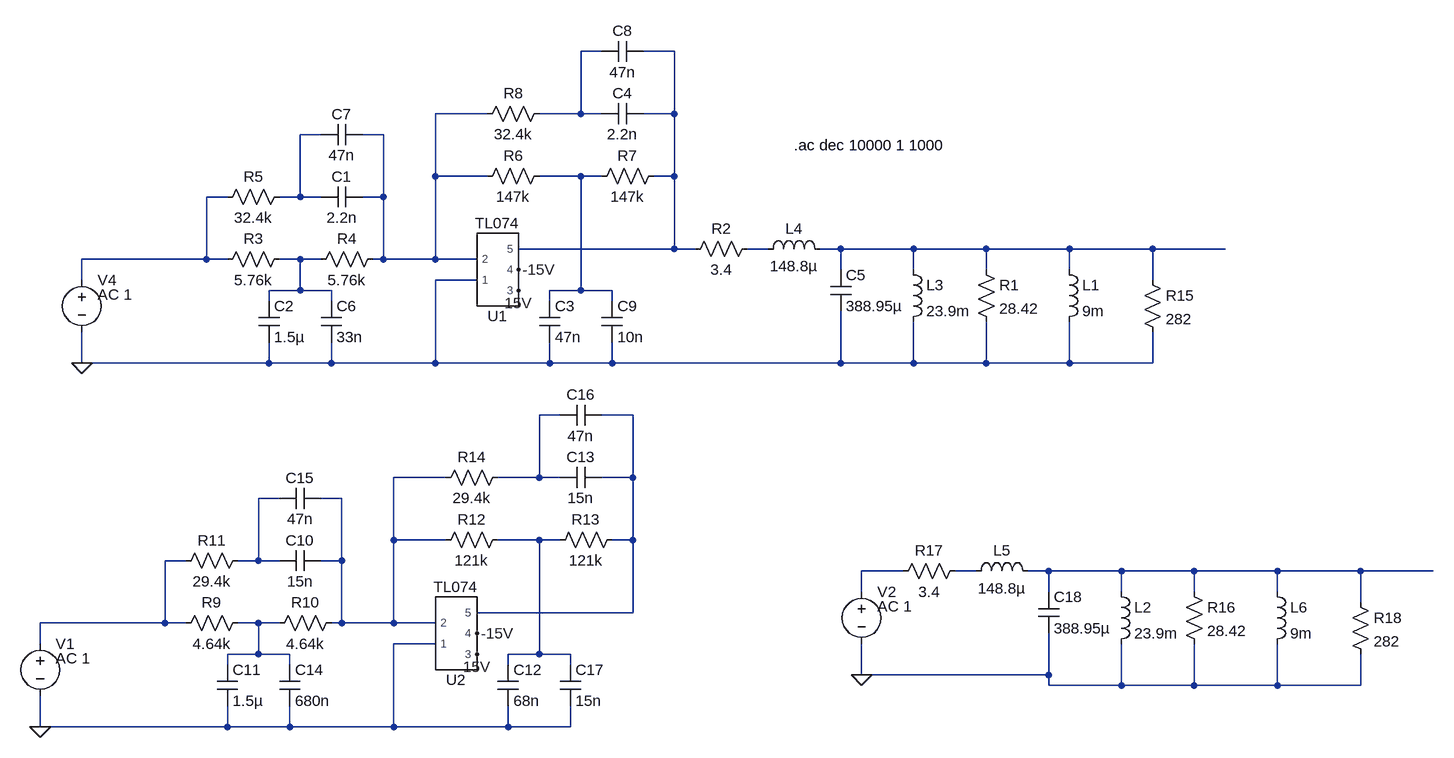
[diagram p0: schematic mounted_pyle_lt.asc]
mounted_pyle_lt.asc, the LTspice schematic file:
Version 4
SHEET 1 1108 1520
WIRE -576 448 -608 448
WIRE -464 448 -512 448
WIRE -752 544 -832 544
WIRE -608 544 -608 448
WIRE -608 544 -672 544
WIRE -576 544 -608 544
WIRE -464 544 -464 448
WIRE -464 544 -512 544
WIRE -1008 576 -1040 576
WIRE -912 576 -944 576
WIRE -832 640 -832 544
WIRE -752 640 -832 640
WIRE -608 640 -672 640
WIRE -576 640 -608 640
WIRE -464 640 -464 544
WIRE -464 640 -496 640
WIRE -1152 672 -1184 672
WIRE -1040 672 -1040 576
WIRE -1040 672 -1072 672
WIRE -1008 672 -1040 672
WIRE -912 672 -912 576
WIRE -912 672 -944 672
WIRE -464 752 -464 640
WIRE -464 752 -704 752
WIRE -432 752 -464 752
WIRE -320 752 -352 752
WIRE -208 752 -240 752
WIRE -96 752 -208 752
WIRE 16 752 -96 752
WIRE 144 752 16 752
WIRE 272 752 144 752
WIRE 384 752 272 752
WIRE -1184 768 -1184 672
WIRE -1184 768 -1376 768
WIRE -1152 768 -1184 768
WIRE -1040 768 -1072 768
WIRE -1008 768 -1040 768
WIRE -912 768 -912 672
WIRE -912 768 -928 768
WIRE -832 768 -832 640
WIRE -832 768 -912 768
WIRE -768 768 -832 768
WIRE -208 784 -208 752
WIRE -96 784 -96 752
WIRE 16 784 16 752
WIRE 144 784 144 752
WIRE -1376 800 -1376 768
WIRE -768 800 -832 800
WIRE 272 800 272 752
WIRE -1040 816 -1040 768
WIRE -1040 816 -1088 816
WIRE -992 816 -1040 816
WIRE -608 816 -608 640
WIRE -608 816 -656 816
WIRE -560 816 -608 816
WIRE -1088 832 -1088 816
WIRE -992 832 -992 816
WIRE -656 832 -656 816
WIRE -560 832 -560 816
WIRE -1376 928 -1376 880
WIRE -1088 928 -1088 896
WIRE -1088 928 -1376 928
WIRE -992 928 -992 896
WIRE -992 928 -1088 928
WIRE -832 928 -832 800
WIRE -832 928 -992 928
WIRE -656 928 -656 896
WIRE -656 928 -832 928
WIRE -560 928 -560 896
WIRE -560 928 -656 928
WIRE -208 928 -208 848
WIRE -208 928 -560 928
WIRE -96 928 -96 864
WIRE -96 928 -208 928
WIRE 16 928 16 864
WIRE 16 928 -96 928
WIRE 144 928 144 864
WIRE 144 928 16 928
WIRE 272 928 272 880
WIRE 272 928 144 928
WIRE -640 1008 -672 1008
WIRE -528 1008 -576 1008
WIRE -816 1104 -896 1104
WIRE -672 1104 -672 1008
WIRE -672 1104 -736 1104
WIRE -640 1104 -672 1104
WIRE -528 1104 -528 1008
WIRE -528 1104 -576 1104
WIRE -1072 1136 -1104 1136
WIRE -976 1136 -1008 1136
WIRE -896 1200 -896 1104
WIRE -816 1200 -896 1200
WIRE -672 1200 -736 1200
WIRE -640 1200 -672 1200
WIRE -528 1200 -528 1104
WIRE -528 1200 -560 1200
WIRE -1216 1232 -1248 1232
WIRE -1104 1232 -1104 1136
WIRE -1104 1232 -1136 1232
WIRE -1072 1232 -1104 1232
WIRE -976 1232 -976 1136
WIRE -976 1232 -1008 1232
WIRE -112 1248 -176 1248
WIRE 0 1248 -32 1248
WIRE 112 1248 80 1248
WIRE 224 1248 112 1248
WIRE 336 1248 224 1248
WIRE 464 1248 336 1248
WIRE 592 1248 464 1248
WIRE 704 1248 592 1248
WIRE -176 1280 -176 1248
WIRE 112 1280 112 1248
WIRE 224 1280 224 1248
WIRE 336 1280 336 1248
WIRE 464 1280 464 1248
WIRE 592 1296 592 1248
WIRE -528 1312 -528 1200
WIRE -528 1312 -768 1312
WIRE -1248 1328 -1248 1232
WIRE -1248 1328 -1440 1328
WIRE -1216 1328 -1248 1328
WIRE -1104 1328 -1136 1328
WIRE -1072 1328 -1104 1328
WIRE -976 1328 -976 1232
WIRE -976 1328 -992 1328
WIRE -896 1328 -896 1200
WIRE -896 1328 -976 1328
WIRE -832 1328 -896 1328
WIRE -1440 1360 -1440 1328
WIRE -832 1360 -896 1360
WIRE -1104 1376 -1104 1328
WIRE -1104 1376 -1152 1376
WIRE -1056 1376 -1104 1376
WIRE -672 1376 -672 1200
WIRE -672 1376 -720 1376
WIRE -624 1376 -672 1376
WIRE -1152 1392 -1152 1376
WIRE -1056 1392 -1056 1376
WIRE -720 1392 -720 1376
WIRE -624 1392 -624 1376
WIRE -176 1408 -176 1360
WIRE 112 1408 112 1344
WIRE 112 1408 -176 1408
WIRE 112 1424 112 1408
WIRE 224 1424 224 1360
WIRE 224 1424 112 1424
WIRE 336 1424 336 1360
WIRE 336 1424 224 1424
WIRE 464 1424 464 1360
WIRE 464 1424 336 1424
WIRE 592 1424 592 1376
WIRE 592 1424 464 1424
WIRE -1440 1488 -1440 1440
WIRE -1152 1488 -1152 1456
WIRE -1152 1488 -1440 1488
WIRE -1056 1488 -1056 1456
WIRE -1056 1488 -1152 1488
WIRE -896 1488 -896 1360
WIRE -896 1488 -1056 1488
WIRE -720 1488 -720 1456
WIRE -720 1488 -896 1488
WIRE -624 1488 -624 1456
WIRE -624 1488 -720 1488
FLAG -1376 928 0
FLAG -704 816 15V
FLAG -704 784 -15V
FLAG -176 1408 0
FLAG -1440 1488 0
FLAG -768 1376 15V
FLAG -768 1344 -15V
SYMBOL cap -224 784 R0
SYMATTR InstName C5
SYMATTR Value 388.95µ
SYMBOL ind -112 768 R0
SYMATTR InstName L3
SYMATTR Value 23.9m
SYMBOL res 0 768 R0
SYMATTR InstName R1
SYMATTR Value 28.42
SYMBOL res -336 736 R90
WINDOW 0 0 56 VBottom 2
WINDOW 3 32 56 VTop 2
SYMATTR InstName R2
SYMATTR Value 3.4
SYMBOL ind -336 768 R270
WINDOW 0 32 56 VTop 2
WINDOW 3 5 56 VBottom 2
SYMATTR InstName L4
SYMATTR Value 148.8µ
SYMBOL voltage -1376 784 R0
WINDOW 123 24 38 Left 2
WINDOW 39 0 0 Left 0
SYMATTR Value2 AC 1
SYMATTR InstName V4
SYMATTR Value ""
SYMBOL ind 128 768 R0
SYMATTR InstName L1
SYMATTR Value 9m
SYMBOL res 256 784 R0
SYMATTR InstName R15
SYMATTR Value 282
SYMBOL res -1056 752 R90
WINDOW 0 0 56 VBottom 2
WINDOW 3 32 56 VTop 2
SYMATTR InstName R3
SYMATTR Value 5.76k
SYMBOL res -912 752 R90
WINDOW 0 0 56 VBottom 2
WINDOW 3 32 56 VTop 2
SYMATTR InstName R4
SYMATTR Value 5.76k
SYMBOL res -1056 656 R90
WINDOW 0 0 56 VBottom 2
WINDOW 3 32 56 VTop 2
SYMATTR InstName R5
SYMATTR Value 32.4k
SYMBOL cap -944 656 R90
WINDOW 0 0 32 VBottom 2
WINDOW 3 32 32 VTop 2
SYMATTR InstName C1
SYMATTR Value 2.2n
SYMBOL cap -1104 832 R0
SYMATTR InstName C2
SYMATTR Value 1.5µ
SYMBOL res -656 624 R90
WINDOW 0 0 56 VBottom 2
WINDOW 3 32 56 VTop 2
SYMATTR InstName R6
SYMATTR Value 147k
SYMBOL cap -672 832 R0
SYMATTR InstName C3
SYMATTR Value 47n
SYMBOL res -480 624 R90
WINDOW 0 0 56 VBottom 2
WINDOW 3 32 56 VTop 2
SYMATTR InstName R7
SYMATTR Value 147k
SYMBOL res -656 528 R90
WINDOW 0 0 56 VBottom 2
WINDOW 3 32 56 VTop 2
SYMATTR InstName R8
SYMATTR Value 32.4k
SYMBOL cap -512 528 R90
WINDOW 0 0 32 VBottom 2
WINDOW 3 32 32 VTop 2
SYMATTR InstName C4
SYMATTR Value 2.2n
SYMBOL cap -1008 832 R0
SYMATTR InstName C6
SYMATTR Value 33n
SYMBOL cap -944 560 R90
WINDOW 0 0 32 VBottom 2
WINDOW 3 32 32 VTop 2
SYMATTR InstName C7
SYMATTR Value 47n
SYMBOL cap -512 432 R90
WINDOW 0 0 32 VBottom 2
WINDOW 3 32 32 VTop 2
SYMATTR InstName C8
SYMATTR Value 47n
SYMBOL cap -576 832 R0
SYMATTR InstName C9
SYMATTR Value 10n
SYMBOL AutoGenerated/TL074 -736 784 M180
SYMATTR InstName U1
SYMBOL cap 96 1280 R0
SYMATTR InstName C18
SYMATTR Value 388.95µ
SYMBOL ind 208 1264 R0
SYMATTR InstName L2
SYMATTR Value 23.9m
SYMBOL res 320 1264 R0
SYMATTR InstName R16
SYMATTR Value 28.42
SYMBOL res -16 1232 R90
WINDOW 0 0 56 VBottom 2
WINDOW 3 32 56 VTop 2
SYMATTR InstName R17
SYMATTR Value 3.4
SYMBOL ind -16 1264 R270
WINDOW 0 32 56 VTop 2
WINDOW 3 5 56 VBottom 2
SYMATTR InstName L5
SYMATTR Value 148.8µ
SYMBOL ind 448 1264 R0
SYMATTR InstName L6
SYMATTR Value 9m
SYMBOL res 576 1280 R0
SYMATTR InstName R18
SYMATTR Value 282
SYMBOL voltage -176 1264 R0
WINDOW 123 24 38 Left 2
WINDOW 39 0 0 Left 0
SYMATTR Value2 AC 1
SYMATTR InstName V2
SYMATTR Value ""
SYMBOL voltage -1440 1344 R0
WINDOW 123 24 38 Left 2
WINDOW 39 0 0 Left 0
SYMATTR Value2 AC 1
SYMATTR InstName V1
SYMATTR Value ""
SYMBOL res -1120 1312 R90
WINDOW 0 0 56 VBottom 2
WINDOW 3 32 56 VTop 2
SYMATTR InstName R9
SYMATTR Value 4.64k
SYMBOL res -976 1312 R90
WINDOW 0 0 56 VBottom 2
WINDOW 3 32 56 VTop 2
SYMATTR InstName R10
SYMATTR Value 4.64k
SYMBOL res -1120 1216 R90
WINDOW 0 0 56 VBottom 2
WINDOW 3 32 56 VTop 2
SYMATTR InstName R11
SYMATTR Value 29.4k
SYMBOL cap -1008 1216 R90
WINDOW 0 0 32 VBottom 2
WINDOW 3 32 32 VTop 2
SYMATTR InstName C10
SYMATTR Value 15n
SYMBOL cap -1168 1392 R0
SYMATTR InstName C11
SYMATTR Value 1.5µ
SYMBOL res -720 1184 R90
WINDOW 0 0 56 VBottom 2
WINDOW 3 32 56 VTop 2
SYMATTR InstName R12
SYMATTR Value 121k
SYMBOL cap -736 1392 R0
SYMATTR InstName C12
SYMATTR Value 68n
SYMBOL res -544 1184 R90
WINDOW 0 0 56 VBottom 2
WINDOW 3 32 56 VTop 2
SYMATTR InstName R13
SYMATTR Value 121k
SYMBOL res -720 1088 R90
WINDOW 0 0 56 VBottom 2
WINDOW 3 32 56 VTop 2
SYMATTR InstName R14
SYMATTR Value 29.4k
SYMBOL cap -576 1088 R90
WINDOW 0 0 32 VBottom 2
WINDOW 3 32 32 VTop 2
SYMATTR InstName C13
SYMATTR Value 15n
SYMBOL cap -1072 1392 R0
SYMATTR InstName C14
SYMATTR Value 680n
SYMBOL cap -1008 1120 R90
WINDOW 0 0 32 VBottom 2
WINDOW 3 32 32 VTop 2
SYMATTR InstName C15
SYMATTR Value 47n
SYMBOL cap -576 992 R90
WINDOW 0 0 32 VBottom 2
WINDOW 3 32 32 VTop 2
SYMATTR InstName C16
SYMATTR Value 47n
SYMBOL cap -640 1392 R0
SYMATTR InstName C17
SYMATTR Value 15n
SYMBOL AutoGenerated/TL074 -800 1344 M180
SYMATTR InstName U2
TEXT -280 592 Left 2 !.ac dec 10000 1 1000

The netlist it stands for:
* mounted_pyle_lt.asc
C5 N008 0 388.95µ
L3 N008 0 23.9m
R1 N008 0 28.42
R2 N007 N002 3.4
L4 N007 N008 148.8µ
V4 N006 0 AC 1
L1 N008 0 9m
R15 N008 0 282
R3 N009 N006 5.76k
R4 N003 N009 5.76k
R5 N004 N006 32.4k
C1 N003 N004 2.2n
C2 N009 0 1.5µ
R6 N005 N003 147k
C3 N005 0 47n
R7 N002 N005 147k
R8 N001 N003 32.4k
C4 N002 N001 2.2n
C6 N009 0 33n
C7 N003 N004 47n
C8 N002 N001 47n
C9 N005 0 10n
XU1 0 N003 15V -15V N002 TL074  ; pins 1 2 3 4 5
C18 N018 0 388.95µ
L2 N018 0 23.9m
R16 N018 0 28.42
R17 N017 N016 3.4
L5 N017 N018 148.8µ
L6 N018 0 9m
R18 N018 0 282
V2 N016 0 AC 1
V1 N015 0 AC 1
R9 N019 N015 4.64k
R10 N012 N019 4.64k
R11 N013 N015 29.4k
C10 N012 N013 15n
C11 N019 0 1.5µ
R12 N014 N012 121k
C12 N014 0 68n
R13 N011 N014 121k
R14 N010 N012 29.4k
C13 N011 N010 15n
C14 N019 0 680n
C15 N012 N013 47n
C16 N011 N010 47n
C17 N014 0 15n
XU2 0 N012 15V -15V N011 TL074  ; pins 1 2 3 4 5
.ac dec 10000 1 1000
.lib /Users/sujit/Documents/UNIVERSITY/3rd Year Project/git/3rd-year-project/OpenLoopDesign/Simulations/LTspice/PylePLPW6D/Datasheet/TL074.301
.backanno
.end